# EAGLE schematic Replicape_B4 (EAGLE 9.5.1)

## Sheet 1 of 6
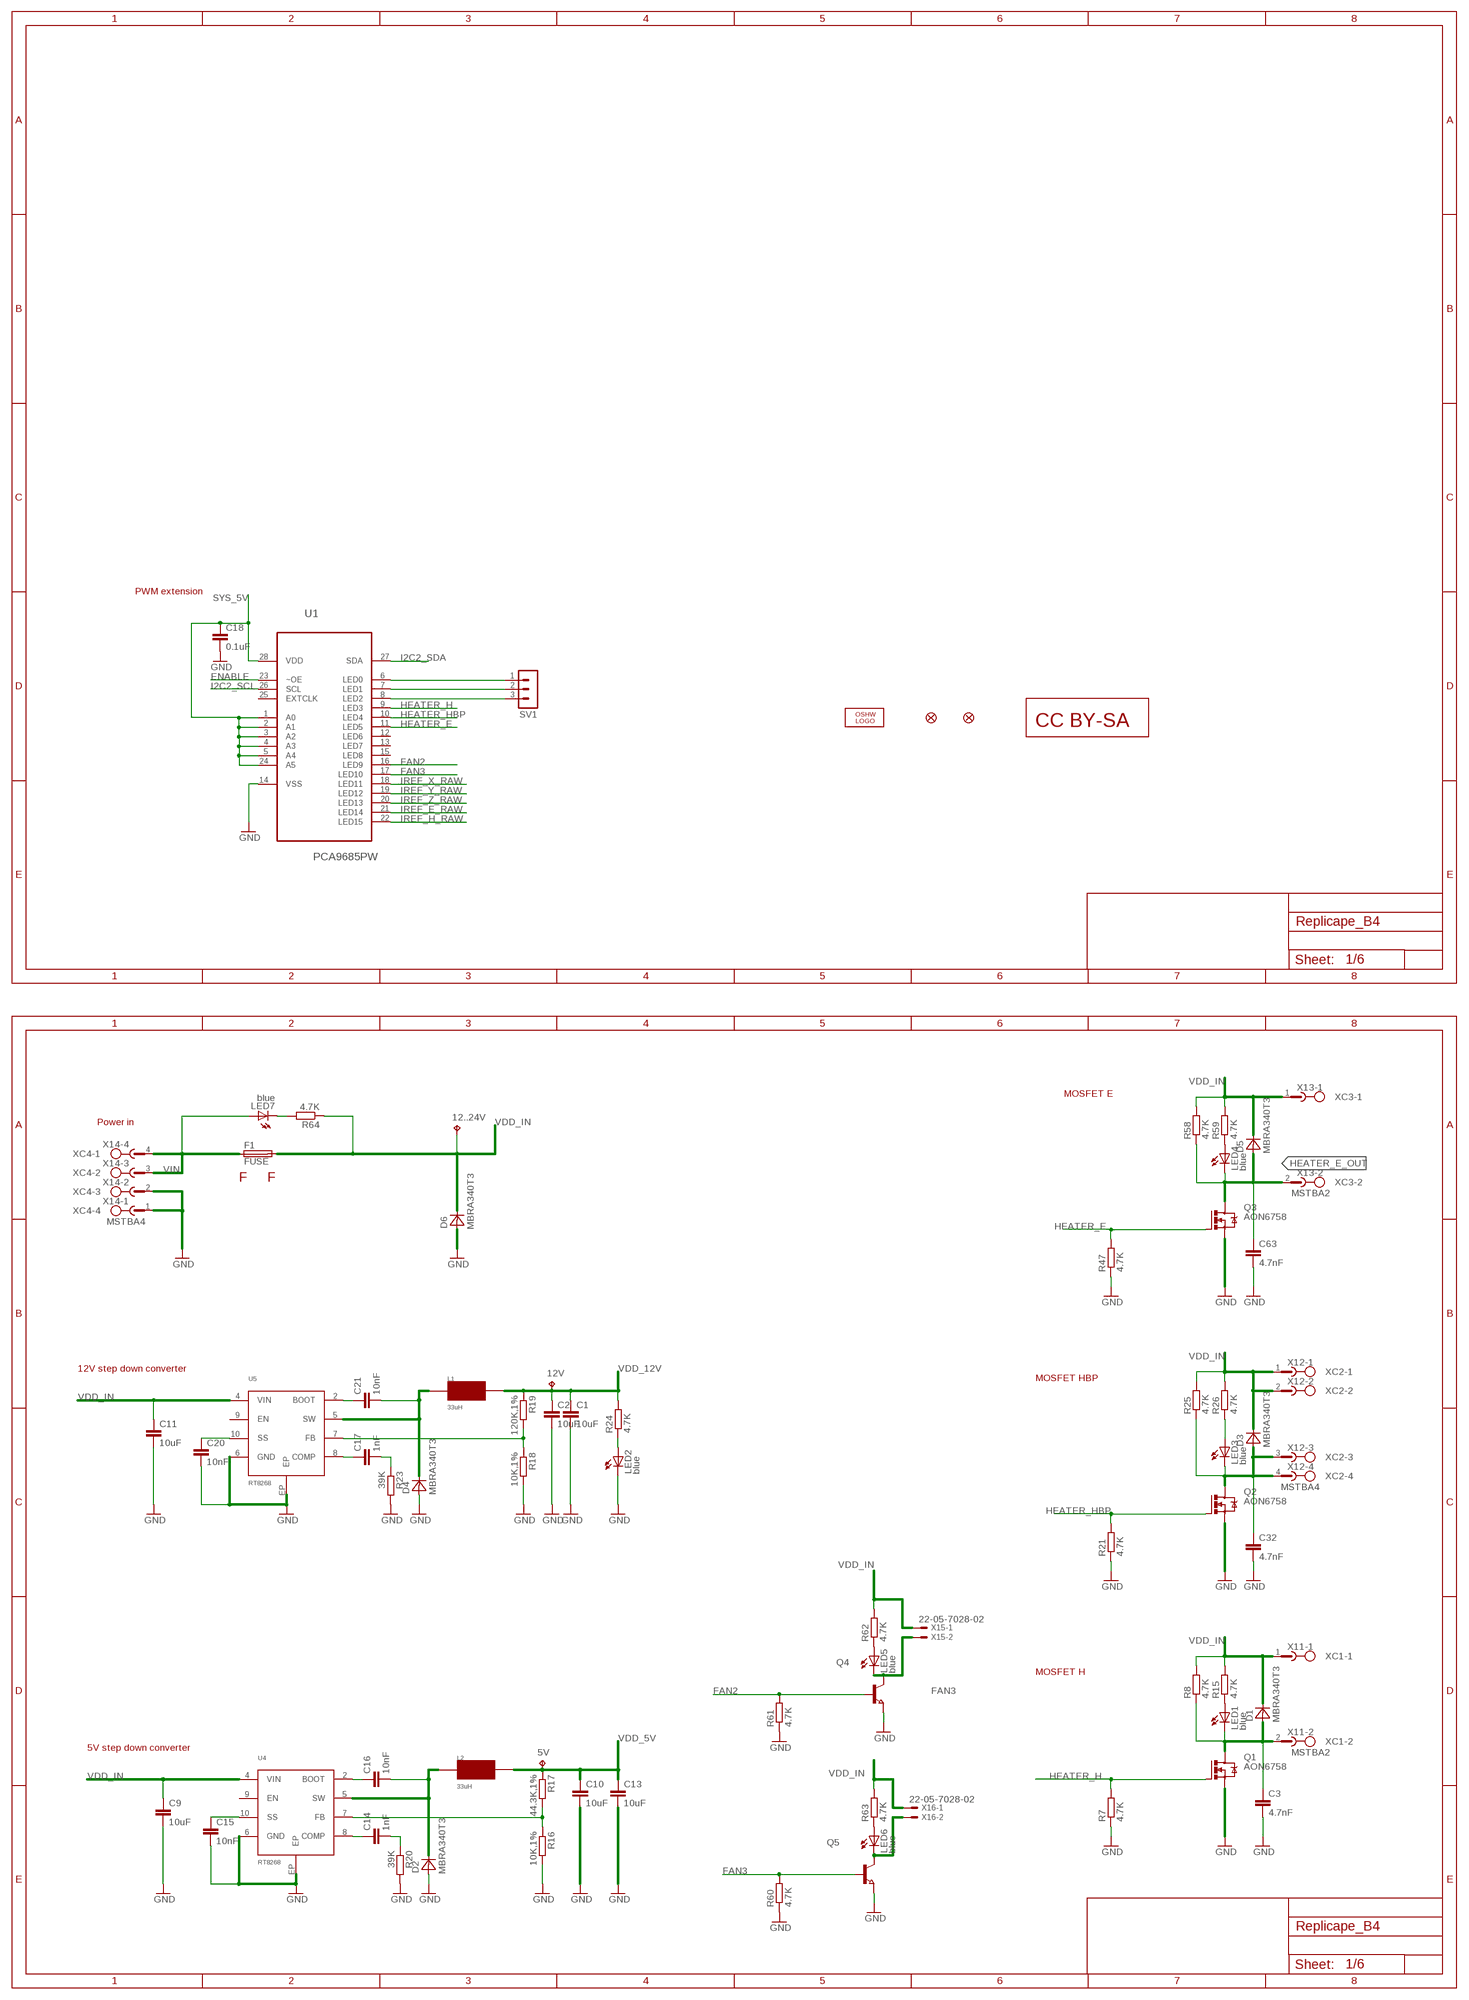
[diagram p0: schematic, sheet 1, part 1 of 2]
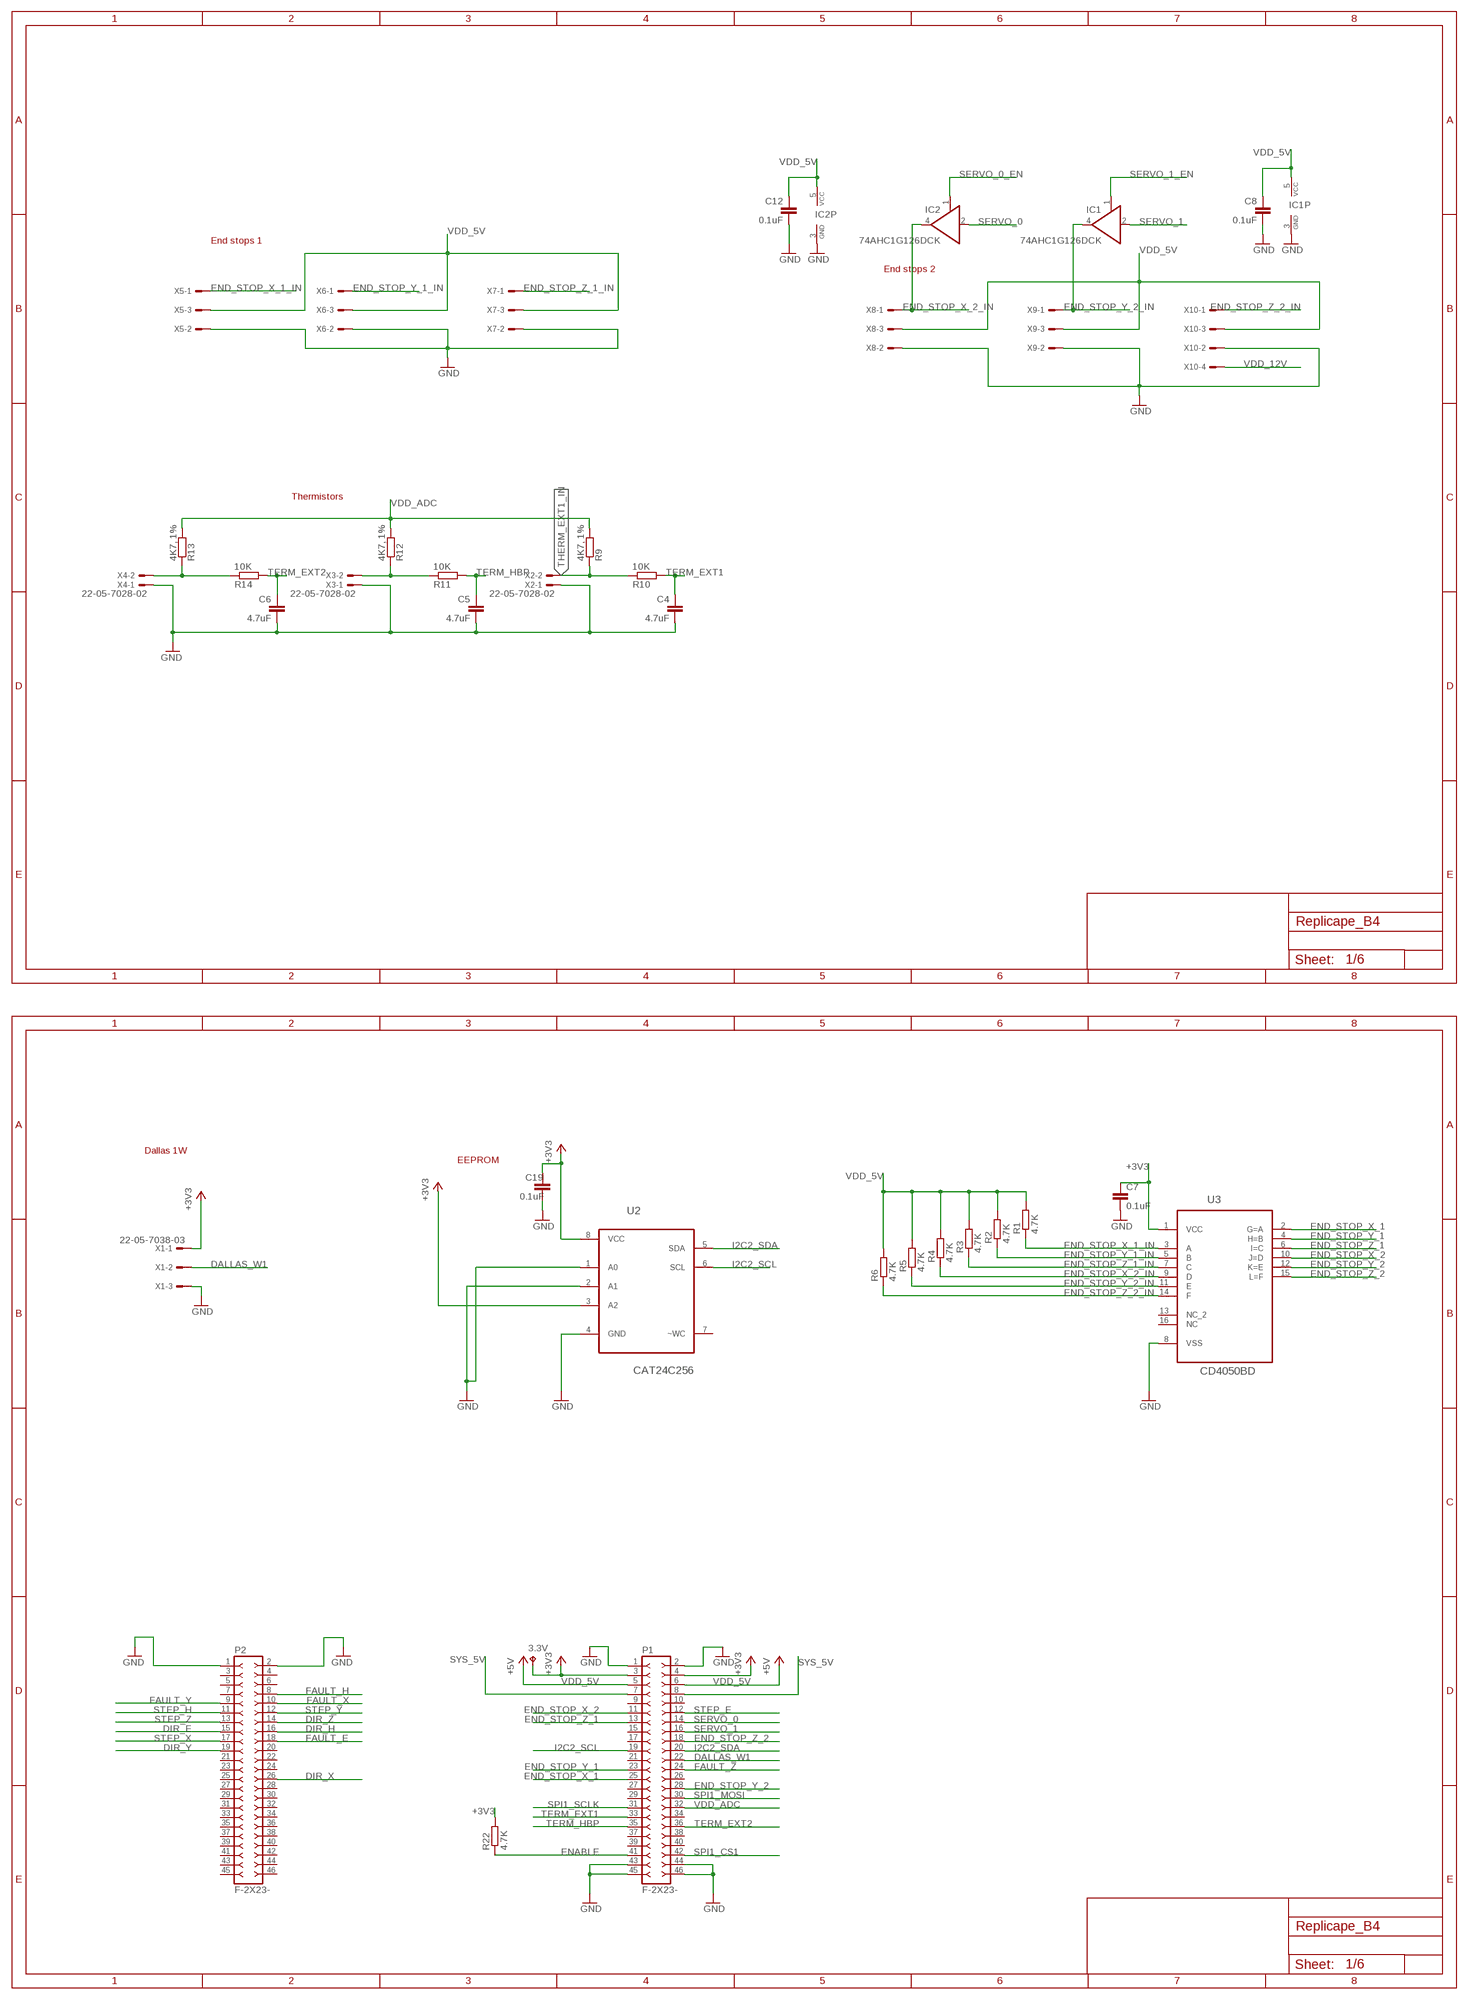
[diagram p1: schematic, sheet 1, part 2 of 2]

### Parts
3.3V  TPB1,27  [B1,27]
5V  TPB1,27  [B1,27]
12..24V  TPB1,27  [B1,27]
12V  TPB1,27  [B1,27]
C1  10uF  C-EUC1206  [C1206]
C2  10uF  C-EUC1206  [C1206]
C3  4.7nF  C-EUC0402  [C0402]
C4  4.7uF  C-EUC0402  [C0402]
C5  4.7uF  C-EUC0402  [C0402]
C6  4.7uF  C-EUC0402  [C0402]
C7  0.1uF  C-EUC0402  [C0402]
C8  0.1uF  C-EUC0402  [C0402]
C9  10uF  C-EUC1206  [C1206]
C10  10uF  C-EUC1206  [C1206]
C11  10uF  C-EUC1206  [C1206]
C12  0.1uF  C-EUC0402  [C0402]
C13  10uF  C-EUC1206  [C1206]
C14  1nF  C-EUC0402  [C0402]
C15  10nF  C-EUC0402  [C0402]
C16  10nF  C-EUC0402  [C0402]
C17  1nF  C-EUC0402  [C0402]
C18  0.1uF  C-EUC0402  [C0402]
C19  0.1uF  C-EUC0402  [C0402]
C20  10nF  C-EUC0402  [C0402]
C21  10nF  C-EUC0402  [C0402]
C32  4.7nF  C-EUC0402  [C0402]
C63  4.7nF  C-EUC0402  [C0402]
D1  MBRA340T3  [SMA]
D2  MBRA340T3  [SMA]
D3  MBRA340T3  [SMA]
D4  MBRA340T3  [SMA]
D5  MBRA340T3  [SMA]
D6  MBRA340T3  [SMA]
F1  FUSE  [3557]
FH1  FUSE-HOLDER  [FUSE-HOLDER]
FH2  FUSE-HOLDER  [FUSE-HOLDER]
IC1  74AHC1G126DCK  [SC70-5]
IC2  74AHC1G126DCK  [SC70-5]
JP1  FIDUCIAL1X2.5  [FIDUCIAL-1X2.5]
JP2  FIDUCIAL1X2.5  [FIDUCIAL-1X2.5]
L1  33uH  RT8040T330  [NR8040T330]
L2  33uH  RT8040T330  [NR8040T330]
LED1  blue  LEDCHIP-LED0603  [CHIP-LED0603]
LED2  blue  LEDCHIP-LED0603  [CHIP-LED0603]
LED3  blue  LEDCHIP-LED0603  [CHIP-LED0603]
LED4  blue  LEDCHIP-LED0603  [CHIP-LED0603]
LED5  blue  LEDCHIP-LED0603  [CHIP-LED0603]
LED6  blue  LEDCHIP-LED0603  [CHIP-LED0603]
LED7  blue  LEDCHIP-LED0603  [CHIP-LED0603]
LOGO1  OSHW_LOGO_FILLX0200-NT  [OSHW_FILLX200_NOTEXT]
P1  F-2X23-  [DIL-100-2X23]
P2  F-2X23-  [DIL-100-2X23]
Q1  AON6758  [8-DFN-EP-(5X6)]
Q2  AON6758  [8-DFN-EP-(5X6)]
Q3  AON6758  [8-DFN-EP-(5X6)]
Q4  NPN-TRANSISTOR_SOT23  [SOT23]
Q5  NPN-TRANSISTOR_SOT23  [SOT23]
R1  4.7K  R-EU_R0402  [R0402]
R2  4.7K  R-EU_R0402  [R0402]
R3  4.7K  R-EU_R0402  [R0402]
R4  4.7K  R-EU_R0402  [R0402]
R5  4.7K  R-EU_R0402  [R0402]
R6  4.7K  R-EU_R0402  [R0402]
R7  4.7K  R-EU_R0402  [R0402]
R8  4.7K  R-EU_R0402  [R0402]
R9  4K7, 1%  R-EU_R0402  [R0402]
R10  10K  R-EU_R0402  [R0402]
R11  10K  R-EU_R0402  [R0402]
R12  4K7, 1%  R-EU_R0402  [R0402]
R13  4K7, 1%  R-EU_R0402  [R0402]
R14  10K  R-EU_R0402  [R0402]
R15  4.7K  R-EU_R0402  [R0402]
R16  10K,1%  R-EU_R0402  [R0402]
R17  44.3K,1%  R-EU_R0402  [R0402]
R18  10K,1%  R-EU_R0402  [R0402]
R19  120K,1%  R-EU_R0402  [R0402]
R20  39K  R-EU_R0402  [R0402]
R21  4.7K  R-EU_R0402  [R0402]
R22  4.7K  R-EU_R0402  [R0402]
R23  39K  R-EU_R0402  [R0402]
R24  4.7K  R-EU_R0402  [R0402]
R25  4.7K  R-EU_R0402  [R0402]
R26  4.7K  R-EU_R0402  [R0402]
R47  4.7K  R-EU_R0402  [R0402]
R58  4.7K  R-EU_R0402  [R0402]
R59  4.7K  R-EU_R0402  [R0402]
R60  4.7K  R-EU_R0402  [R0402]
R61  4.7K  R-EU_R0402  [R0402]
R62  4.7K  R-EU_R0402  [R0402]
R63  4.7K  R-EU_R0402  [R0402]
R64  4.7K  R-EU_R0402  [R0402]
SV1  MA03-1  [MA03-1]
U1  PCA9685PW  [SOP65P640X110-28N]
U2  CAT24C256  [SOIC127P600X175-8N]
U3  CD4050BD  [SOIC127P600X175-16N]
U4  RT8268  [MSOP10]
U5  RT8268  [MSOP10]
U$1  CC-BY-SA  [CC-BY-SA]
X1  22-05-7038-03  [7395-03]
X2  22-05-7028-02  [7395-02]
X3  22-05-7028-02  [7395-02]
X4  22-05-7028-02  [7395-02]
X5  22-05-7038-03  [7395-03]
X6  22-05-7038-03  [7395-03]
X7  22-05-7038-03  [7395-03]
X8  22-05-7038-03  [7395-03]
X9  22-05-7038-03  [7395-03]
X10  22-05-7048-04  [7395-04]
X11  MSTBA2  [MSTBA2]
X12  MSTBA4  [MSTBA4]
X13  MSTBA2  [MSTBA2]
X14  MSTBA4  [MSTBA4]
X15  22-05-7028-02  [7395-02]
X16  22-05-7028-02  [7395-02]
XC1  MSTBV2-CONNECTOR  [MSTBA2-CONNECTOR]
XC2  MSTBA4-CONNECTOR  [MSTBA4-CONNECTOR]
XC3  MSTBV2-CONNECTOR  [MSTBA2-CONNECTOR]
XC4  MSTBA4-CONNECTOR  [MSTBA4-CONNECTOR]

### Nets
+3V3: 3.3V.TP C7.1 C19.1 P1.3 P1.4 R22.2 U2.3(A2) U2.8(VCC) U3.1(VCC) X1.1 ; also sheet 2,3,4,5,6
DALLAS_W1: P1.22 X1.2
DIR_E: P2.15 ; also sheet 3
DIR_H: P2.16 ; also sheet 6
DIR_X: P2.26 ; also sheet 4
DIR_Y: P2.19 ; also sheet 5
DIR_Z: P2.14 ; also sheet 2
ENABLE: P1.41 R22.1 U1.23(~OE)
END_STOP_X_1: P1.25 U3.2(G=A)
END_STOP_X_1_IN: R1.1 U3.3(A) X5.1
END_STOP_X_2: P1.11 U3.10(J=D)
END_STOP_X_2_IN: IC2.4(O) R4.1 U3.9(D) X8.1
END_STOP_Y_1: P1.23 U3.4(H=B)
END_STOP_Y_1_IN: R2.1 U3.5(B) X6.1
END_STOP_Y_2: P1.28 U3.12(K=E)
END_STOP_Y_2_IN: IC1.4(O) R5.1 U3.11(E) X9.1
END_STOP_Z_1: P1.13 U3.6(I=C)
END_STOP_Z_1_IN: R3.1 U3.7(C) X7.1
END_STOP_Z_2: P1.18 U3.15(L=F)
END_STOP_Z_2_IN: R6.1 U3.14(F) X10.1
FAN2: Q4.1(B) R61.2 U1.16(LED9)
FAN3: Q5.1(B) R60.2 U1.17(LED10)
FAULT_E: P2.18 ; also sheet 3
FAULT_H: P2.8 ; also sheet 6
FAULT_X: P2.10 ; also sheet 4
FAULT_Y: P2.9 ; also sheet 5
FAULT_Z: P1.24 ; also sheet 2
GND: C1.2 C2.2 C3.2 C4.2 C5.2 C6.2 C7.2 C8.2 C9.2 C10.2 C11.2 C12.2 C13.2 C15.2 C18.2 C19.2 C20.2 C32.2 C63.2 D2.A D4.A D6.A IC1.3(GND) IC2.3(GND) LED2.C P1.1 P1.2 P1.43 P1.44 P1.45 P1.46 P2.1 P2.2 Q1.1(S) Q1.2(S) Q1.3(S) Q2.1(S) Q2.2(S) Q2.3(S) Q3.1(S) Q3.2(S) Q3.3(S) Q4.2(E) Q5.2(E) R7.1 R16.2 R18.2 R20.2 R21.1 R23.2 R47.1 R60.1 R61.1 U1.14(VSS) U2.1(A0) U2.2(A1) U2.4(GND) U3.8(VSS) U4.6(GND) U4.EP U5.6(GND) U5.EP X1.3 X2.1 X3.1 X4.1 X5.2 X6.2 X7.2 X8.2 X9.2 X10.2 X14.1 X14.2 ; also sheet 2,3,4,5,6
HEATER_E: Q3.4(G) R47.2 U1.11(LED5)
HEATER_E_OUT: C63.1 D5.A LED4.C Q3.5(D) Q3.6(D) Q3.7(D) Q3.8(D) Q3.TH(D) R58.1 X13.2
HEATER_H: Q1.4(G) R7.2 U1.9(LED3)
HEATER_HBP: Q2.4(G) R21.2 U1.10(LED4)
I2C2_SCL: P1.19 U1.26(SCL) U2.6(SCL)
I2C2_SDA: P1.20 U1.27(SDA) U2.5(SDA)
IREF_E_RAW: U1.21(LED14) ; also sheet 3
IREF_H_RAW: U1.22(LED15) ; also sheet 6
IREF_X_RAW: U1.18(LED11) ; also sheet 4
IREF_Y_RAW: U1.19(LED12) ; also sheet 5
IREF_Z_RAW: U1.20(LED13) ; also sheet 2
N$1: SV1.1 U1.6(LED0)
N$8: LED7.C R64.2
N$23: R16.1 R17.2 U4.7(FB)
N$25: C16.2 D2.C L2.P$2 U4.5(SW)
N$60: C15.1 U4.10(SS)
N$64: C3.1 D1.A LED1.C Q1.5(D) Q1.6(D) Q1.7(D) Q1.8(D) Q1.TH(D) R8.1 X11.2
N$73: C16.1 U4.2(BOOT)
N$88: C14.1 U4.8(COMP)
N$96: LED2.A R24.1
N$97: C14.2 R20.1
N$114: LED6.C Q5.3(C) X16.2
N$115: LED5.C Q4.3(C) X15.2
N$117: LED5.A R62.1
N$118: LED6.A R63.1
N$120: SV1.3 U1.8(LED2)
N$121: SV1.2 U1.7(LED1)
N$127: LED4.A R59.1
N$129: LED1.A R15.1
N$130: LED3.A R26.1
N$233: R18.1 R19.2 U5.7(FB)
N$238: C21.2 D4.C L1.P$2 U5.5(SW)
N$240: R13.1 R14.1 X4.2
N$241: R11.1 R12.1 X3.2
N$242: C32.1 D3.A LED3.C Q2.5(D) Q2.6(D) Q2.7(D) Q2.8(D) Q2.TH(D) R25.1 X12.3 X12.4
N$243: C20.1 U5.10(SS)
N$244: C17.1 U5.8(COMP)
N$245: C21.1 U5.2(BOOT)
N$246: C17.2 R23.1
SERVO_0: IC2.2(I) P1.14
SERVO_0_EN: IC2.1(OE) ; also sheet 5
SERVO_1: IC1.2(I) P1.16
SERVO_1_EN: IC1.1(OE) ; also sheet 2
SPI1_CS1: P1.42 ; also sheet 2,3,4,5,6
SPI1_MOSI: P1.30 ; also sheet 4
SPI1_SCLK: P1.31 ; also sheet 2,3,4,5,6
STEP_E: P1.12 ; also sheet 3
STEP_H: P2.11 ; also sheet 6
STEP_X: P2.17 ; also sheet 4
STEP_Y: P2.12 ; also sheet 5
STEP_Z: P2.13 ; also sheet 2
SYS_5V: C18.1 P1.7 P1.8 U1.1(A0) U1.2(A1) U1.3(A2) U1.4(A3) U1.5(A4) U1.24(A5) U1.28(VDD)
TERM_EXT1: C4.1 P1.33 R10.2
TERM_EXT2: C6.1 P1.36 R14.2
TERM_HBP: C5.1 P1.35 R11.2
THERM_EXT1_IN: R9.1 R10.1 X2.2
VDD_5V: 5V.TP C8.1 C10.1 C12.1 C13.1 IC1.5(VCC) IC2.5(VCC) L2.P$1 P1.5 P1.6 R1.2 R2.2 R3.2 R4.2 R5.2 R6.2 R17.1 X5.3 X6.3 X7.3 X8.3 X9.3 X10.3 ; supply symbol labelled +5V
VDD_12V: 12V.TP C1.1 C2.1 L1.P$1 R19.1 R24.2 X10.4
VDD_ADC: P1.32 R9.2 R12.2 R13.2
VDD_IN: 12..24V.TP C9.1 C11.1 D1.C D3.C D5.C D6.C F1.P$3 F1.P$4 R8.2 R15.2 R25.2 R26.2 R58.2 R59.2 R62.2 R63.2 R64.1 U4.4(VIN) U5.4(VIN) X11.1 X12.1 X12.2 X13.1 X15.1 X16.1 ; also sheet 2,3,4,5,6
VIN: F1.P$1 F1.P$2 LED7.A X14.3 X14.4
Unconnected: P1.9 P1.10 P1.15 P1.17 P1.21 P1.26 P1.27 P1.29 P1.34 P1.37 P1.38 P1.39 P1.40 P2.3 P2.4 P2.5 P2.6 P2.7 P2.20 P2.21 P2.22 P2.23 P2.24 P2.25 P2.27 P2.28 P2.29 P2.30 P2.31 P2.32 P2.33 P2.34 P2.35 P2.36 P2.37 P2.38 P2.39 P2.40 P2.41 P2.42 P2.43 P2.44 P2.45 P2.46 U1.12(LED6) U1.13(LED7) U1.15(LED8) U1.25(EXTCLK) U2.7(~WC) U3.13(NC_2) U3.16(NC) U4.9(EN) U5.9(EN)

### Notes on the sheet
- End stops 1
- End stops 2
- Thermistors
- PWM extension
- MOSFET E
- Power in
- Dallas 1W
- EEPROM
- 12V step down converter
- MOSFET HBP
- MOSFET H
- 5V step down converter

## Sheet 2 of 6
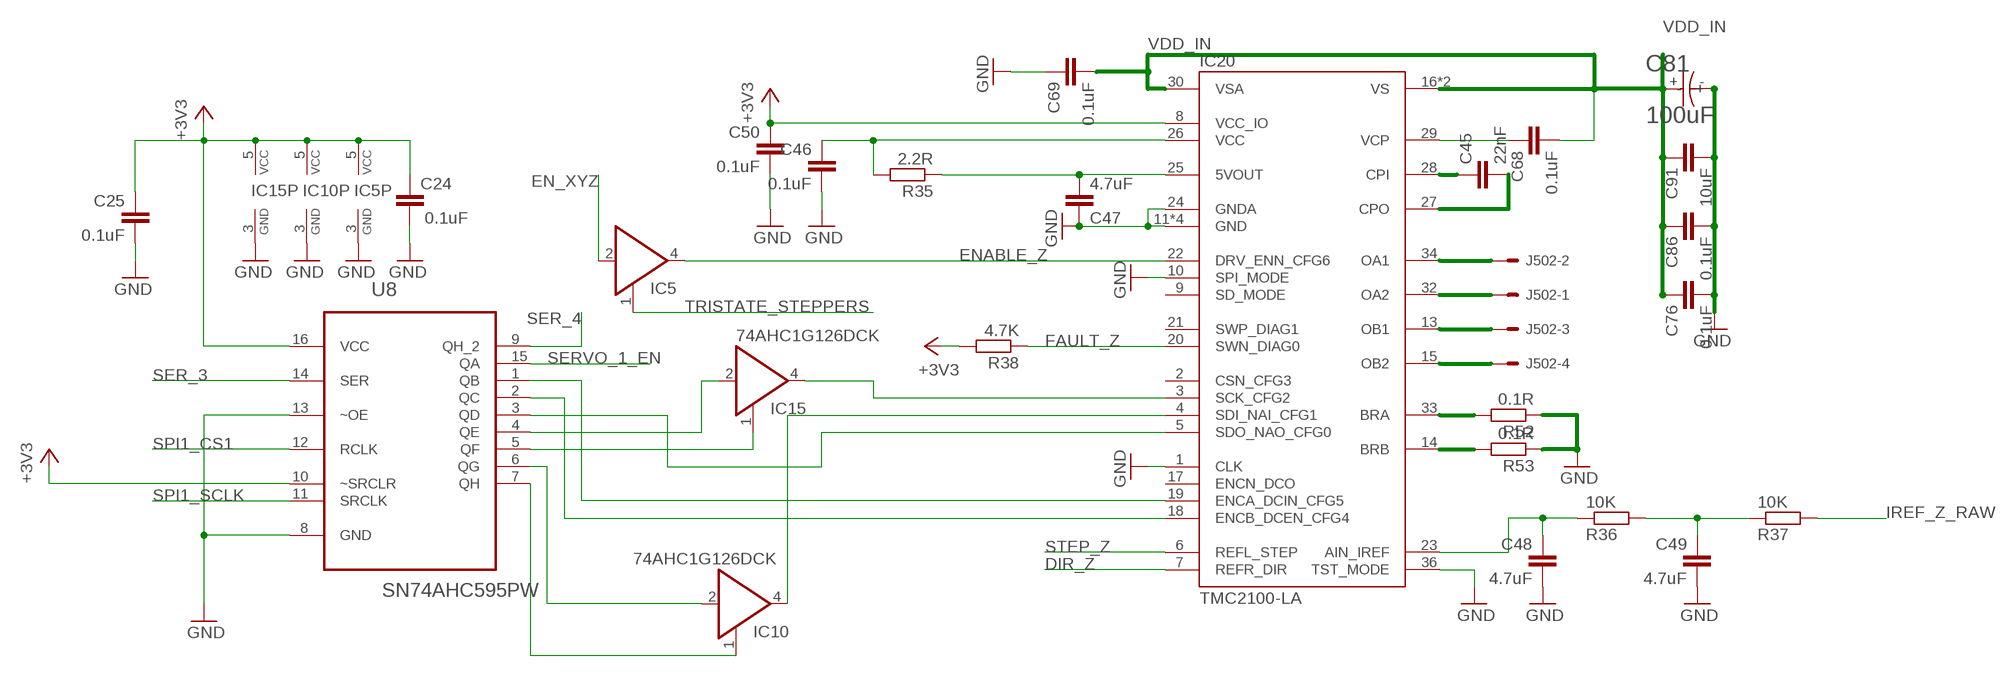
[diagram p2: schematic, sheet 2]

### Parts
C24  0.1uF  C-EUC0402  [C0402]
C25  0.1uF  C-EUC0402  [C0402]
C45  22nF  C-EUC0402  [C0402]
C46  0.1uF  C-EUC0402  [C0402]
C47  4.7uF  C-EUC0402  [C0402]
C48  4.7uF  C-EUC0402  [C0402]
C49  4.7uF  C-EUC0402  [C0402]
C50  0.1uF  C-EUC0402  [C0402]
C68  0.1uF  C-EUC0402  [C0402]
C69  0.1uF  C-EUC0402  [C0402]
C76  0.1uF  C-EUC0402  [C0402]
C81  100uF  C  [RHS1V10MCN1GS]
C86  0.1uF  C-EUC0402  [C0402]
C91  10uF  C-EUC0805  [C0805]
IC5  74AHC1G126DCK  [SC70-5]
IC10  74AHC1G126DCK  [SC70-5]
IC15  74AHC1G126DCK  [SC70-5]
IC20  TMC2100-LA  [QFN36-PAD]
J502  22-05-7048-04  [7395-04]
R35  2.2R  R-EU_R0402  [R0402]
R36  10K  R-EU_R0402  [R0402]
R37  10K  R-EU_R0402  [R0402]
R38  4.7K  R-EU_R0402  [R0402]
R52  0.1R  R-EU_R0805  [R0805]
R53  0.1R  R-EU_R0805  [R0805]
U8  SN74AHC595PW  [SOP65P640X120-16N]

### Nets
+3V3: C24.1 C25.1 C50.1 IC5.5(VCC) IC10.5(VCC) IC15.5(VCC) IC20.8(VCC_IO) R38.2 U8.10(~SRCLR) U8.16(VCC) ; also sheet 1,3,4,5,6
DIR_Z: IC20.7(REFR_DIR) ; also sheet 1
EN_XYZ: IC5.2(I) ; also sheet 4,5
ENABLE_Z: IC5.4(O) IC20.22(DRV_ENN_CFG6)
FAULT_Z: IC20.20(SWN_DIAG0) R38.1 ; also sheet 1
GND: C24.2 C25.2 C46.2 C47.1 C48.2 C49.2 C50.2 C69.1 C76.2 C81.- C86.2 C91.2 IC5.3(GND) IC10.3(GND) IC15.3(GND) IC20.1(CLK) IC20.10(SPI_MODE) IC20.11(GND) IC20.12(GND) IC20.24(GNDA) IC20.35(GND) IC20.36(TST_MODE) IC20.TP(GND) R52.1 R53.1 U8.8(GND) U8.13(~OE) ; also sheet 1,3,4,5,6
IREF_Z6: C49.1 R36.2 R37.1
IREF_Z_RAW: R37.2 ; also sheet 1
N$2: C45.2 IC20.27(CPO)
N$3: IC20.14(BRB) R53.2
N$4: IC20.33(BRA) R52.2
N$5: C48.1 IC20.23(AIN_IREF) R36.1
N$6: C45.1 IC20.28(CPI)
N$12: IC15.4(O) IC20.3(SCK_CFG2)
N$13: C47.2 IC20.25(5VOUT) R35.1
N$14: C68.1 IC20.29(VCP)
N$15: IC10.4(O) IC20.4(SDI_NAI_CFG1)
N$16: IC20.5(SDO_NAO_CFG0) U8.3(QD)
N$17: IC20.18(ENCB_DCEN_CFG4) U8.2(QC)
N$18: IC20.19(ENCA_DCIN_CFG5) U8.1(QB)
N$19: IC10.1(OE) U8.7(QH)
N$20: IC10.2(I) U8.6(QG)
N$22: IC15.2(I) U8.4(QE)
N$24: IC15.1(OE) U8.5(QF)
N$26: C46.1 IC20.26(VCC) R35.2
N$122: IC20.15(OB2) J502.4
N$123: IC20.34(OA1) J502.2
N$138: IC20.32(OA2) J502.1
N$139: IC20.13(OB1) J502.3
SER_3: U8.14(SER) ; also sheet 5
SER_4: U8.9(QH_2) ; also sheet 3
SERVO_1_EN: U8.15(QA) ; also sheet 1
SPI1_CS1: U8.12(RCLK) ; also sheet 1,3,4,5,6
SPI1_SCLK: U8.11(SRCLK) ; also sheet 1,3,4,5,6
STEP_Z: IC20.6(REFL_STEP) ; also sheet 1
TRISTATE_STEPPERS: IC5.1(OE) ; also sheet 3,4,5,6
VDD_IN: C68.2 C69.2 C76.1 C81.+ C86.1 C91.1 IC20.16(VS) IC20.30(VSA) IC20.31(VS) ; also sheet 1,3,4,5,6
Unconnected: IC20.2(CSN_CFG3) IC20.9(SD_MODE) IC20.17(ENCN_DCO) IC20.21(SWP_DIAG1)

## Sheet 3 of 6
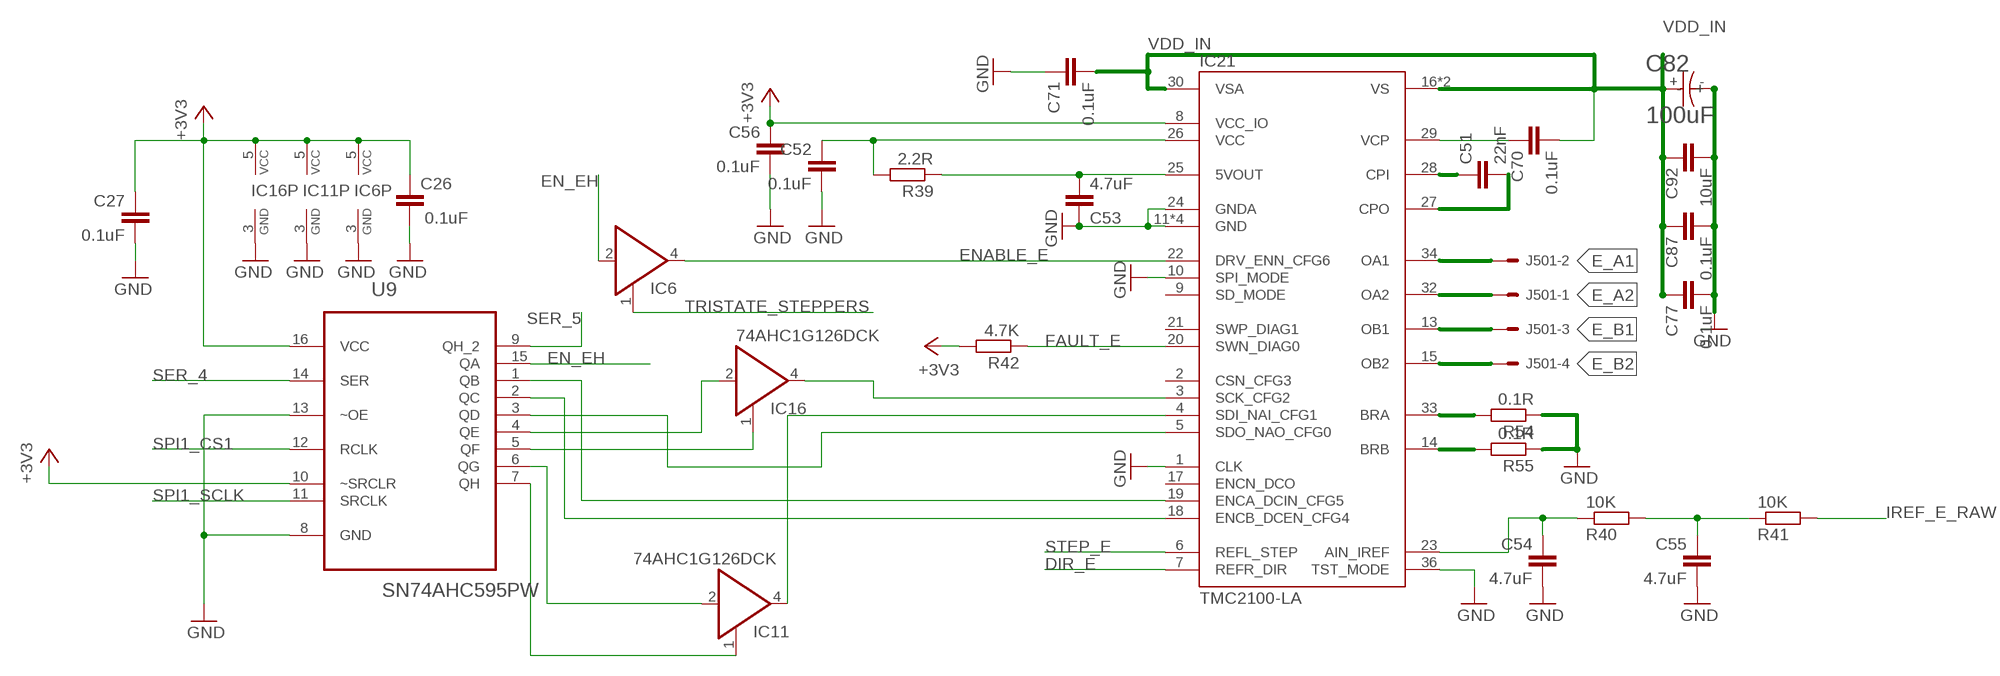
[diagram p3: schematic, sheet 3]

### Parts
C26  0.1uF  C-EUC0402  [C0402]
C27  0.1uF  C-EUC0402  [C0402]
C51  22nF  C-EUC0402  [C0402]
C52  0.1uF  C-EUC0402  [C0402]
C53  4.7uF  C-EUC0402  [C0402]
C54  4.7uF  C-EUC0402  [C0402]
C55  4.7uF  C-EUC0402  [C0402]
C56  0.1uF  C-EUC0402  [C0402]
C70  0.1uF  C-EUC0402  [C0402]
C71  0.1uF  C-EUC0402  [C0402]
C77  0.1uF  C-EUC0402  [C0402]
C82  100uF  C  [RHS1V10MCN1GS]
C87  0.1uF  C-EUC0402  [C0402]
C92  10uF  C-EUC0805  [C0805]
IC6  74AHC1G126DCK  [SC70-5]
IC11  74AHC1G126DCK  [SC70-5]
IC16  74AHC1G126DCK  [SC70-5]
IC21  TMC2100-LA  [QFN36-PAD]
J501  22-05-7048-04  [7395-04]
R39  2.2R  R-EU_R0402  [R0402]
R40  10K  R-EU_R0402  [R0402]
R41  10K  R-EU_R0402  [R0402]
R42  4.7K  R-EU_R0402  [R0402]
R54  0.1R  R-EU_R0805  [R0805]
R55  0.1R  R-EU_R0805  [R0805]
U9  SN74AHC595PW  [SOP65P640X120-16N]

### Nets
+3V3: C26.1 C27.1 C56.1 IC6.5(VCC) IC11.5(VCC) IC16.5(VCC) IC21.8(VCC_IO) R42.2 U9.10(~SRCLR) U9.16(VCC) ; also sheet 1,2,4,5,6
DIR_E: IC21.7(REFR_DIR) ; also sheet 1
E_A1: IC21.34(OA1) J501.2
E_A2: IC21.32(OA2) J501.1
E_B1: IC21.13(OB1) J501.3
E_B2: IC21.15(OB2) J501.4
EN_EH: IC6.2(I) U9.15(QA) ; also sheet 6
ENABLE_E: IC6.4(O) IC21.22(DRV_ENN_CFG6)
FAULT_E: IC21.20(SWN_DIAG0) R42.1 ; also sheet 1
GND: C26.2 C27.2 C52.2 C53.1 C54.2 C55.2 C56.2 C71.1 C77.2 C82.- C87.2 C92.2 IC6.3(GND) IC11.3(GND) IC16.3(GND) IC21.1(CLK) IC21.10(SPI_MODE) IC21.11(GND) IC21.12(GND) IC21.24(GNDA) IC21.35(GND) IC21.36(TST_MODE) IC21.TP(GND) R54.1 R55.1 U9.8(GND) U9.13(~OE) ; also sheet 1,2,4,5,6
IREF_E_RAW: R41.2 ; also sheet 1
IREF_Z7: C55.1 R40.2 R41.1
N$27: C51.2 IC21.27(CPO)
N$28: IC21.14(BRB) R55.2
N$29: IC21.33(BRA) R54.2
N$30: C54.1 IC21.23(AIN_IREF) R40.1
N$31: C51.1 IC21.28(CPI)
N$32: IC16.4(O) IC21.3(SCK_CFG2)
N$35: C53.2 IC21.25(5VOUT) R39.1
N$36: C70.1 IC21.29(VCP)
N$37: IC11.4(O) IC21.4(SDI_NAI_CFG1)
N$38: IC21.5(SDO_NAO_CFG0) U9.3(QD)
N$40: IC21.18(ENCB_DCEN_CFG4) U9.2(QC)
N$41: IC21.19(ENCA_DCIN_CFG5) U9.1(QB)
N$42: IC11.1(OE) U9.7(QH)
N$43: IC11.2(I) U9.6(QG)
N$44: IC16.2(I) U9.4(QE)
N$45: IC16.1(OE) U9.5(QF)
N$46: C52.1 IC21.26(VCC) R39.2
SER_4: U9.14(SER) ; also sheet 2
SER_5: U9.9(QH_2) ; also sheet 6
SPI1_CS1: U9.12(RCLK) ; also sheet 1,2,4,5,6
SPI1_SCLK: U9.11(SRCLK) ; also sheet 1,2,4,5,6
STEP_E: IC21.6(REFL_STEP) ; also sheet 1
TRISTATE_STEPPERS: IC6.1(OE) ; also sheet 2,4,5,6
VDD_IN: C70.2 C71.2 C77.1 C82.+ C87.1 C92.1 IC21.16(VS) IC21.30(VSA) IC21.31(VS) ; also sheet 1,2,4,5,6
Unconnected: IC21.2(CSN_CFG3) IC21.9(SD_MODE) IC21.17(ENCN_DCO) IC21.21(SWP_DIAG1)

## Sheet 4 of 6
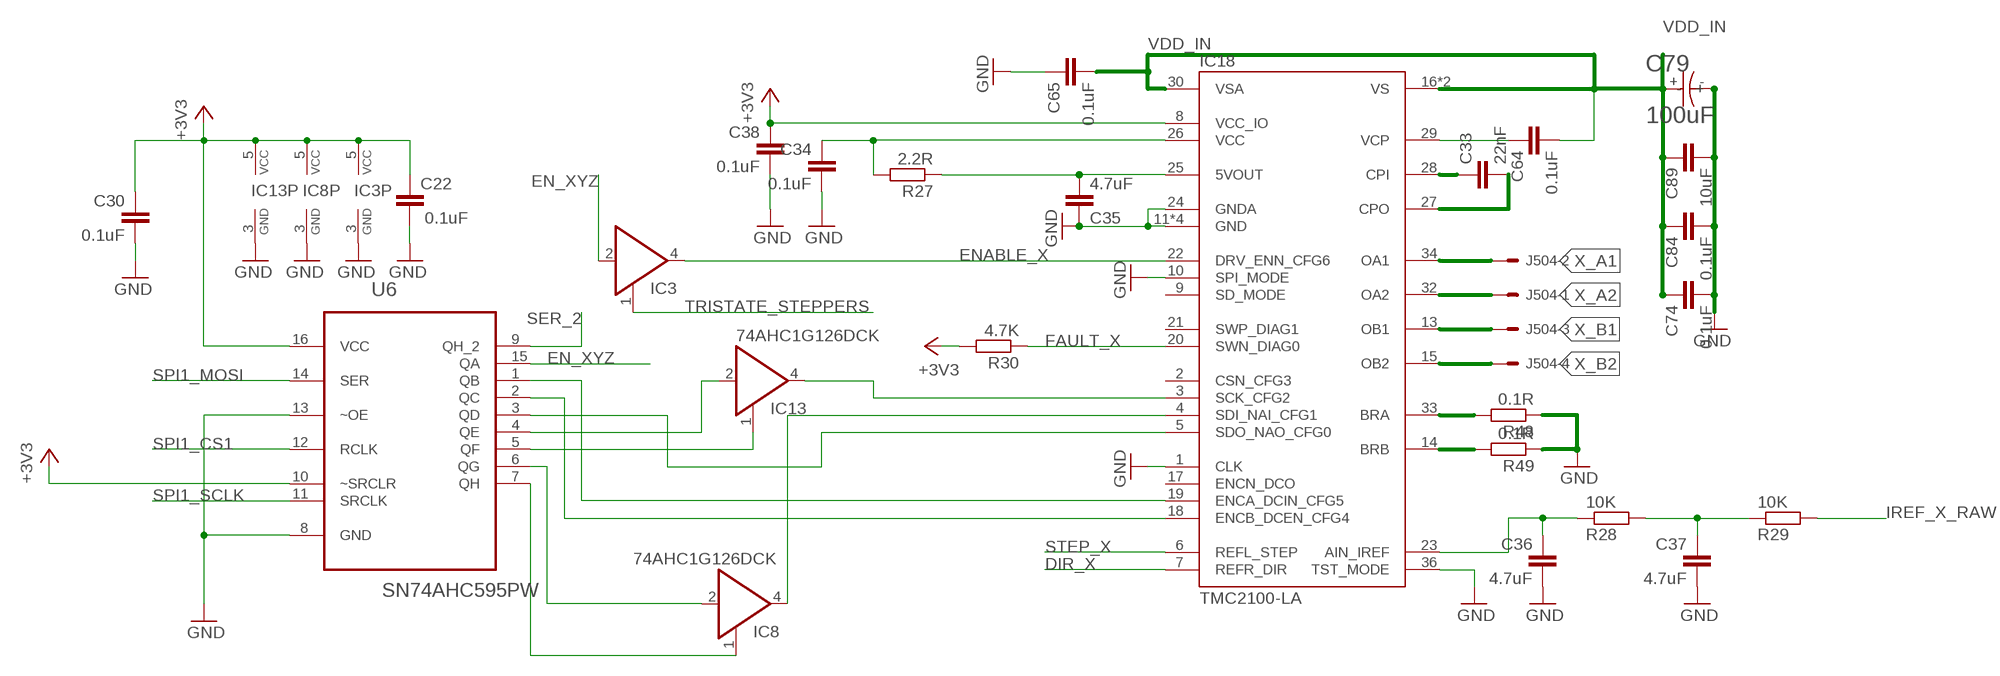
[diagram p4: schematic, sheet 4]

### Parts
C22  0.1uF  C-EUC0402  [C0402]
C30  0.1uF  C-EUC0402  [C0402]
C33  22nF  C-EUC0402  [C0402]
C34  0.1uF  C-EUC0402  [C0402]
C35  4.7uF  C-EUC0402  [C0402]
C36  4.7uF  C-EUC0402  [C0402]
C37  4.7uF  C-EUC0402  [C0402]
C38  0.1uF  C-EUC0402  [C0402]
C64  0.1uF  C-EUC0402  [C0402]
C65  0.1uF  C-EUC0402  [C0402]
C74  0.1uF  C-EUC0402  [C0402]
C79  100uF  C  [RHS1V10MCN1GS]
C84  0.1uF  C-EUC0402  [C0402]
C89  10uF  C-EUC0805  [C0805]
IC3  74AHC1G126DCK  [SC70-5]
IC8  74AHC1G126DCK  [SC70-5]
IC13  74AHC1G126DCK  [SC70-5]
IC18  TMC2100-LA  [QFN36-PAD]
J504  22-05-7048-04  [7395-04]
R27  2.2R  R-EU_R0402  [R0402]
R28  10K  R-EU_R0402  [R0402]
R29  10K  R-EU_R0402  [R0402]
R30  4.7K  R-EU_R0402  [R0402]
R48  0.1R  R-EU_R0805  [R0805]
R49  0.1R  R-EU_R0805  [R0805]
U6  SN74AHC595PW  [SOP65P640X120-16N]

### Nets
+3V3: C22.1 C30.1 C38.1 IC3.5(VCC) IC8.5(VCC) IC13.5(VCC) IC18.8(VCC_IO) R30.2 U6.10(~SRCLR) U6.16(VCC) ; also sheet 1,2,3,5,6
DIR_X: IC18.7(REFR_DIR) ; also sheet 1
EN_XYZ: IC3.2(I) U6.15(QA) ; also sheet 2,5
ENABLE_X: IC3.4(O) IC18.22(DRV_ENN_CFG6)
FAULT_X: IC18.20(SWN_DIAG0) R30.1 ; also sheet 1
GND: C22.2 C30.2 C34.2 C35.1 C36.2 C37.2 C38.2 C65.1 C74.2 C79.- C84.2 C89.2 IC3.3(GND) IC8.3(GND) IC13.3(GND) IC18.1(CLK) IC18.10(SPI_MODE) IC18.11(GND) IC18.12(GND) IC18.24(GNDA) IC18.35(GND) IC18.36(TST_MODE) IC18.TP(GND) R48.1 R49.1 U6.8(GND) U6.13(~OE) ; also sheet 1,2,3,5,6
IREF_X_RAW: R29.2 ; also sheet 1
IREF_Z8: C37.1 R28.2 R29.1
N$49: C33.2 IC18.27(CPO)
N$50: IC18.14(BRB) R49.2
N$51: IC18.33(BRA) R48.2
N$52: C36.1 IC18.23(AIN_IREF) R28.1
N$53: C33.1 IC18.28(CPI)
N$54: IC13.4(O) IC18.3(SCK_CFG2)
N$57: C35.2 IC18.25(5VOUT) R27.1
N$58: C64.1 IC18.29(VCP)
N$59: IC8.4(O) IC18.4(SDI_NAI_CFG1)
N$61: IC18.5(SDO_NAO_CFG0) U6.3(QD)
N$62: IC18.18(ENCB_DCEN_CFG4) U6.2(QC)
N$63: IC18.19(ENCA_DCIN_CFG5) U6.1(QB)
N$65: IC8.1(OE) U6.7(QH)
N$66: IC8.2(I) U6.6(QG)
N$67: IC13.2(I) U6.4(QE)
N$68: IC13.1(OE) U6.5(QF)
N$69: C34.1 IC18.26(VCC) R27.2
SER_2: U6.9(QH_2) ; also sheet 5
SPI1_CS1: U6.12(RCLK) ; also sheet 1,2,3,5,6
SPI1_MOSI: U6.14(SER) ; also sheet 1
SPI1_SCLK: U6.11(SRCLK) ; also sheet 1,2,3,5,6
STEP_X: IC18.6(REFL_STEP) ; also sheet 1
TRISTATE_STEPPERS: IC3.1(OE) ; also sheet 2,3,5,6
VDD_IN: C64.2 C65.2 C74.1 C79.+ C84.1 C89.1 IC18.16(VS) IC18.30(VSA) IC18.31(VS) ; also sheet 1,2,3,5,6
X_A1: IC18.34(OA1) J504.2
X_A2: IC18.32(OA2) J504.1
X_B1: IC18.13(OB1) J504.3
X_B2: IC18.15(OB2) J504.4
Unconnected: IC18.2(CSN_CFG3) IC18.9(SD_MODE) IC18.17(ENCN_DCO) IC18.21(SWP_DIAG1)

## Sheet 5 of 6
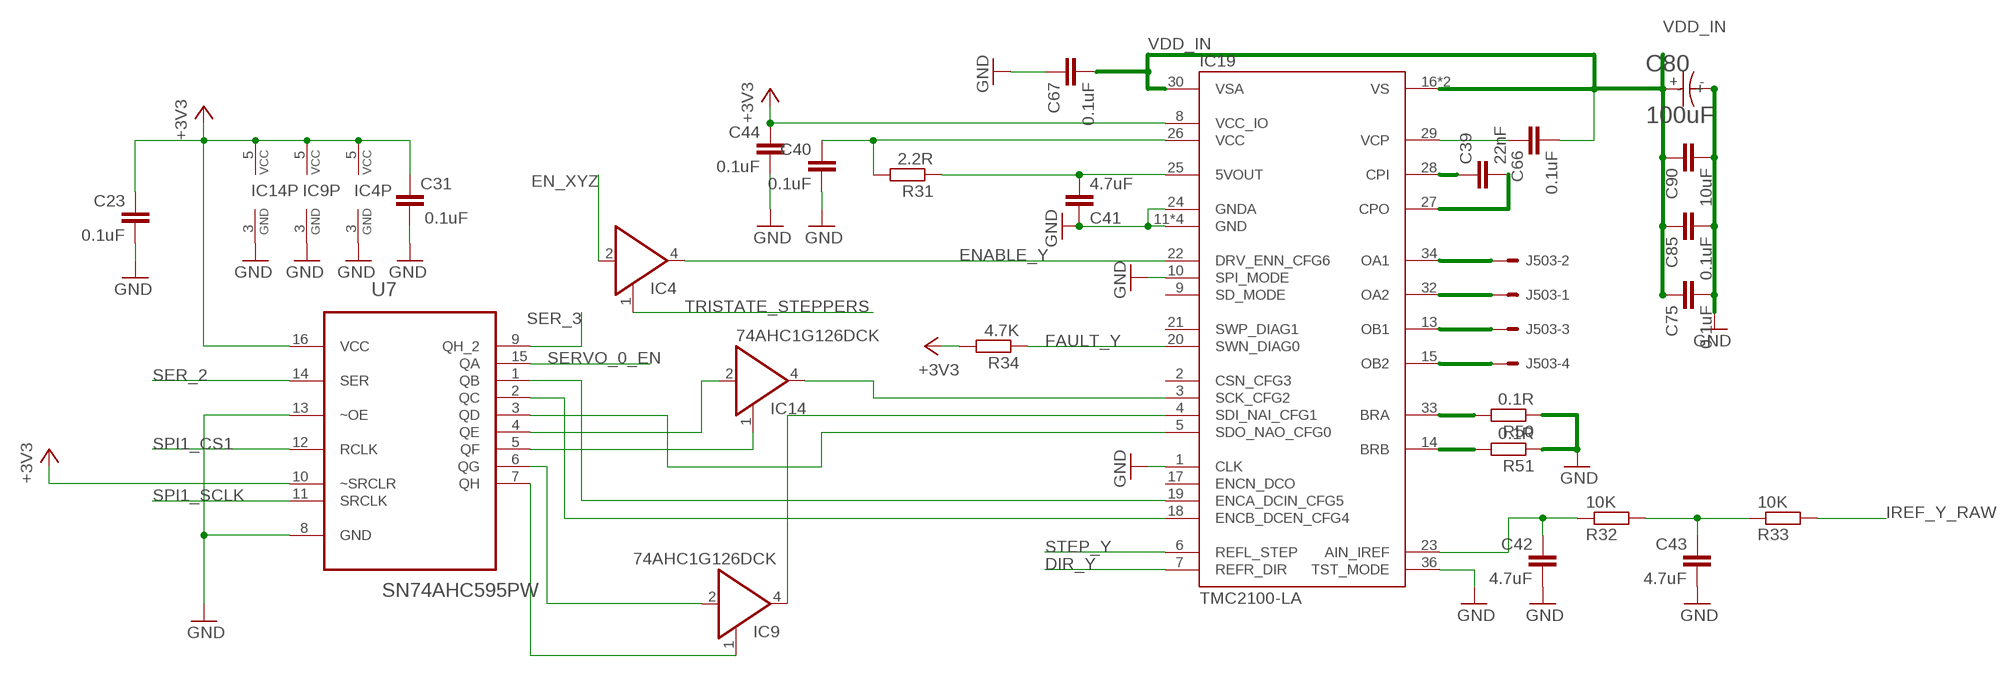
[diagram p5: schematic, sheet 5]

### Parts
C23  0.1uF  C-EUC0402  [C0402]
C31  0.1uF  C-EUC0402  [C0402]
C39  22nF  C-EUC0402  [C0402]
C40  0.1uF  C-EUC0402  [C0402]
C41  4.7uF  C-EUC0402  [C0402]
C42  4.7uF  C-EUC0402  [C0402]
C43  4.7uF  C-EUC0402  [C0402]
C44  0.1uF  C-EUC0402  [C0402]
C66  0.1uF  C-EUC0402  [C0402]
C67  0.1uF  C-EUC0402  [C0402]
C75  0.1uF  C-EUC0402  [C0402]
C80  100uF  C  [RHS1V10MCN1GS]
C85  0.1uF  C-EUC0402  [C0402]
C90  10uF  C-EUC0805  [C0805]
IC4  74AHC1G126DCK  [SC70-5]
IC9  74AHC1G126DCK  [SC70-5]
IC14  74AHC1G126DCK  [SC70-5]
IC19  TMC2100-LA  [QFN36-PAD]
J503  22-05-7048-04  [7395-04]
R31  2.2R  R-EU_R0402  [R0402]
R32  10K  R-EU_R0402  [R0402]
R33  10K  R-EU_R0402  [R0402]
R34  4.7K  R-EU_R0402  [R0402]
R50  0.1R  R-EU_R0805  [R0805]
R51  0.1R  R-EU_R0805  [R0805]
U7  SN74AHC595PW  [SOP65P640X120-16N]

### Nets
+3V3: C23.1 C31.1 C44.1 IC4.5(VCC) IC9.5(VCC) IC14.5(VCC) IC19.8(VCC_IO) R34.2 U7.10(~SRCLR) U7.16(VCC) ; also sheet 1,2,3,4,6
DIR_Y: IC19.7(REFR_DIR) ; also sheet 1
EN_XYZ: IC4.2(I) ; also sheet 2,4
ENABLE_Y: IC4.4(O) IC19.22(DRV_ENN_CFG6)
FAULT_Y: IC19.20(SWN_DIAG0) R34.1 ; also sheet 1
GND: C23.2 C31.2 C40.2 C41.1 C42.2 C43.2 C44.2 C67.1 C75.2 C80.- C85.2 C90.2 IC4.3(GND) IC9.3(GND) IC14.3(GND) IC19.1(CLK) IC19.10(SPI_MODE) IC19.11(GND) IC19.12(GND) IC19.24(GNDA) IC19.35(GND) IC19.36(TST_MODE) IC19.TP(GND) R50.1 R51.1 U7.8(GND) U7.13(~OE) ; also sheet 1,2,3,4,6
IREF_Y_RAW: R33.2 ; also sheet 1
IREF_Z9: C43.1 R32.2 R33.1
N$72: C39.2 IC19.27(CPO)
N$74: IC19.14(BRB) R51.2
N$75: IC19.33(BRA) R50.2
N$76: C42.1 IC19.23(AIN_IREF) R32.1
N$79: C39.1 IC19.28(CPI)
N$80: IC14.4(O) IC19.3(SCK_CFG2)
N$81: IC19.15(OB2) J503.4
N$82: IC19.34(OA1) J503.2
N$83: C41.2 IC19.25(5VOUT) R31.1
N$84: C66.1 IC19.29(VCP)
N$85: IC9.4(O) IC19.4(SDI_NAI_CFG1)
N$86: IC19.5(SDO_NAO_CFG0) U7.3(QD)
N$87: IC19.18(ENCB_DCEN_CFG4) U7.2(QC)
N$89: IC19.19(ENCA_DCIN_CFG5) U7.1(QB)
N$90: IC9.1(OE) U7.7(QH)
N$91: IC9.2(I) U7.6(QG)
N$92: IC14.2(I) U7.4(QE)
N$93: IC14.1(OE) U7.5(QF)
N$94: C40.1 IC19.26(VCC) R31.2
N$95: IC19.32(OA2) J503.1
N$98: IC19.13(OB1) J503.3
SER_2: U7.14(SER) ; also sheet 4
SER_3: U7.9(QH_2) ; also sheet 2
SERVO_0_EN: U7.15(QA) ; also sheet 1
SPI1_CS1: U7.12(RCLK) ; also sheet 1,2,3,4,6
SPI1_SCLK: U7.11(SRCLK) ; also sheet 1,2,3,4,6
STEP_Y: IC19.6(REFL_STEP) ; also sheet 1
TRISTATE_STEPPERS: IC4.1(OE) ; also sheet 2,3,4,6
VDD_IN: C66.2 C67.2 C75.1 C80.+ C85.1 C90.1 IC19.16(VS) IC19.30(VSA) IC19.31(VS) ; also sheet 1,2,3,4,6
Unconnected: IC19.2(CSN_CFG3) IC19.9(SD_MODE) IC19.17(ENCN_DCO) IC19.21(SWP_DIAG1)

## Sheet 6 of 6
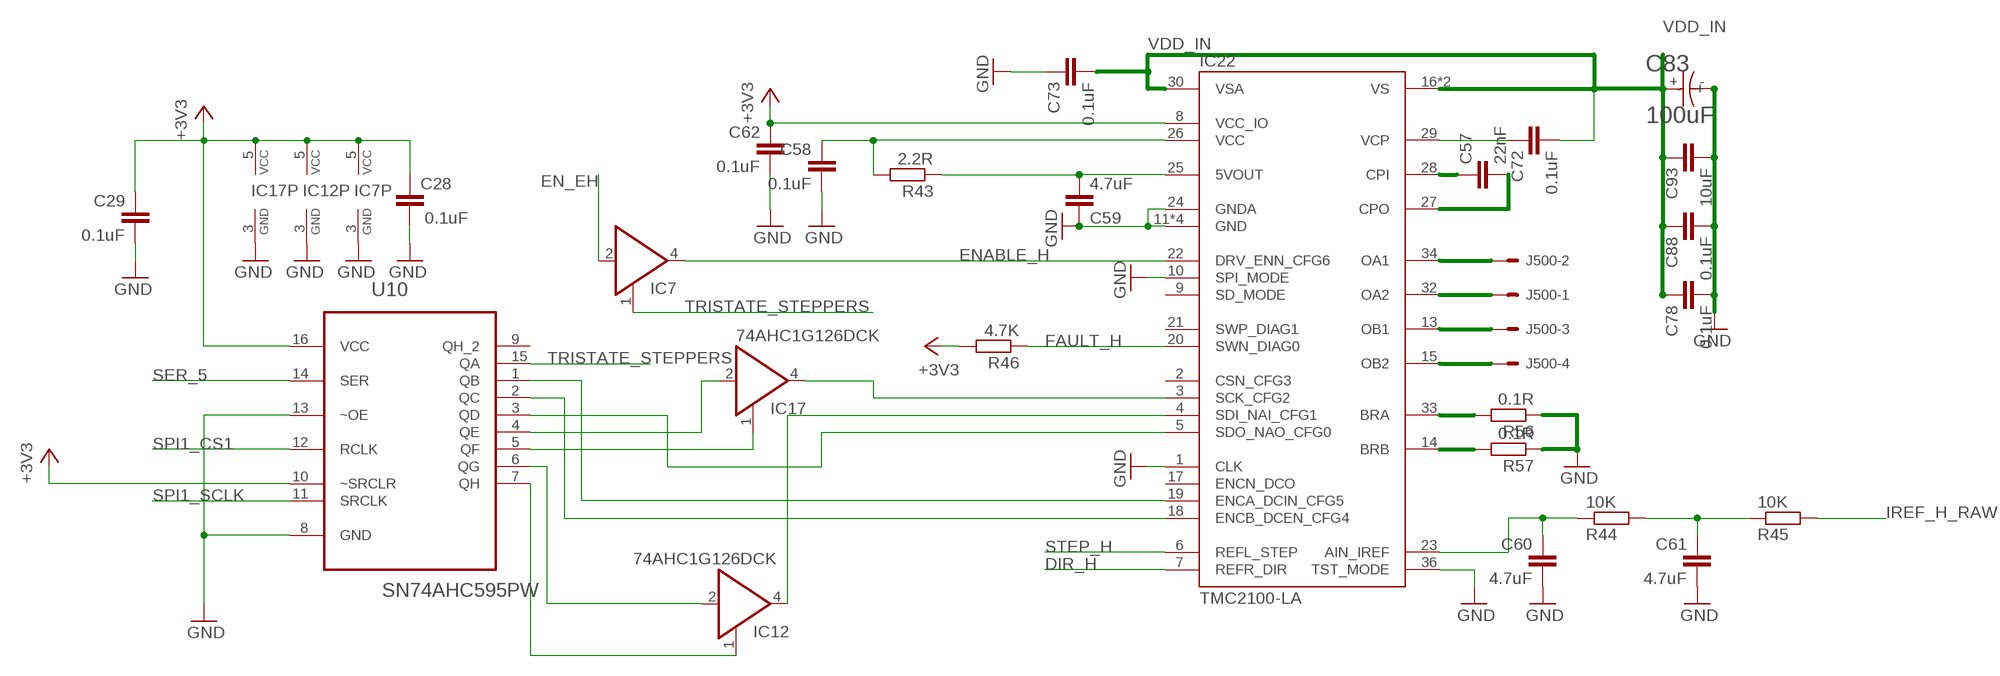
[diagram p6: schematic, sheet 6]

### Parts
C28  0.1uF  C-EUC0402  [C0402]
C29  0.1uF  C-EUC0402  [C0402]
C57  22nF  C-EUC0402  [C0402]
C58  0.1uF  C-EUC0402  [C0402]
C59  4.7uF  C-EUC0402  [C0402]
C60  4.7uF  C-EUC0402  [C0402]
C61  4.7uF  C-EUC0402  [C0402]
C62  0.1uF  C-EUC0402  [C0402]
C72  0.1uF  C-EUC0402  [C0402]
C73  0.1uF  C-EUC0402  [C0402]
C78  0.1uF  C-EUC0402  [C0402]
C83  100uF  C  [RHS1V10MCN1GS]
C88  0.1uF  C-EUC0402  [C0402]
C93  10uF  C-EUC0805  [C0805]
IC7  74AHC1G126DCK  [SC70-5]
IC12  74AHC1G126DCK  [SC70-5]
IC17  74AHC1G126DCK  [SC70-5]
IC22  TMC2100-LA  [QFN36-PAD]
J500  22-05-7048-04  [7395-04]
R43  2.2R  R-EU_R0402  [R0402]
R44  10K  R-EU_R0402  [R0402]
R45  10K  R-EU_R0402  [R0402]
R46  4.7K  R-EU_R0402  [R0402]
R56  0.1R  R-EU_R0805  [R0805]
R57  0.1R  R-EU_R0805  [R0805]
U10  SN74AHC595PW  [SOP65P640X120-16N]

### Nets
+3V3: C28.1 C29.1 C62.1 IC7.5(VCC) IC12.5(VCC) IC17.5(VCC) IC22.8(VCC_IO) R46.2 U10.10(~SRCLR) U10.16(VCC) ; also sheet 1,2,3,4,5
DIR_H: IC22.7(REFR_DIR) ; also sheet 1
EN_EH: IC7.2(I) ; also sheet 3
ENABLE_H: IC7.4(O) IC22.22(DRV_ENN_CFG6)
FAULT_H: IC22.20(SWN_DIAG0) R46.1 ; also sheet 1
GND: C28.2 C29.2 C58.2 C59.1 C60.2 C61.2 C62.2 C73.1 C78.2 C83.- C88.2 C93.2 IC7.3(GND) IC12.3(GND) IC17.3(GND) IC22.1(CLK) IC22.10(SPI_MODE) IC22.11(GND) IC22.12(GND) IC22.24(GNDA) IC22.35(GND) IC22.36(TST_MODE) IC22.TP(GND) R56.1 R57.1 U10.8(GND) U10.13(~OE) ; also sheet 1,2,3,4,5
IREF_H_RAW: R45.2 ; also sheet 1
IREF_Z10: C61.1 R44.2 R45.1
N$99: C57.2 IC22.27(CPO)
N$100: IC22.14(BRB) R57.2
N$101: IC22.33(BRA) R56.2
N$102: C60.1 IC22.23(AIN_IREF) R44.1
N$103: C57.1 IC22.28(CPI)
N$104: IC17.4(O) IC22.3(SCK_CFG2)
N$105: IC22.15(OB2) J500.4
N$106: IC22.34(OA1) J500.2
N$107: C59.2 IC22.25(5VOUT) R43.1
N$108: C72.1 IC22.29(VCP)
N$109: IC12.4(O) IC22.4(SDI_NAI_CFG1)
N$110: IC22.5(SDO_NAO_CFG0) U10.3(QD)
N$111: IC22.18(ENCB_DCEN_CFG4) U10.2(QC)
N$113: IC22.19(ENCA_DCIN_CFG5) U10.1(QB)
N$119: IC12.1(OE) U10.7(QH)
N$167: IC12.2(I) U10.6(QG)
N$168: IC17.2(I) U10.4(QE)
N$180: IC17.1(OE) U10.5(QF)
N$181: C58.1 IC22.26(VCC) R43.2
N$224: IC22.32(OA2) J500.1
N$225: IC22.13(OB1) J500.3
SER_5: U10.14(SER) ; also sheet 3
SPI1_CS1: U10.12(RCLK) ; also sheet 1,2,3,4,5
SPI1_SCLK: U10.11(SRCLK) ; also sheet 1,2,3,4,5
STEP_H: IC22.6(REFL_STEP) ; also sheet 1
TRISTATE_STEPPERS: IC7.1(OE) U10.15(QA) ; also sheet 2,3,4,5
VDD_IN: C72.2 C73.2 C78.1 C83.+ C88.1 C93.1 IC22.16(VS) IC22.30(VSA) IC22.31(VS) ; also sheet 1,2,3,4,5
Unconnected: IC22.2(CSN_CFG3) IC22.9(SD_MODE) IC22.17(ENCN_DCO) IC22.21(SWP_DIAG1) U10.9(QH_2)

## Library data of the parts
3.3V 5V 12..24V 12V = testpad:TP: Test pad
C1 C2 C9-C11 C13 = rcl:C-EU: CAPACITOR, European symbol; MPN: CL31B106KAHNNNE
C3 C32 C63 = rcl:C-EU: CAPACITOR, European symbol; MPN: CL05B472KA5NNNC
C4-C6 C35-C37 C41-C43 C47-C49 C53-C55 C59-C61 = rcl:C-EU: CAPACITOR, European symbol; MPN: GRM155R60J475ME47D
C7 C8 C12 C18 C19 C22-C31 C34 C38 C40 C44 C46 C50 C52 C56 C58 C62 C64-C78 C84-C88 = rcl:C-EU: CAPACITOR, European symbol; MPN: CL10B104KB8NNND
C14 C17 = rcl:C-EU: CAPACITOR, European symbol; MPN: C1005X7R1H102K050BA
C15 C16 C20 C21 = rcl:C-EU: CAPACITOR, European symbol; MPN: CL05B103KB5NNNC
C33 C39 C45 C51 C57 = rcl:C-EU: CAPACITOR, European symbol; MPN: C1005X7R1E223K050BB
C79-C83 = Panasonic-EEEFK_EEEFP:C; MPN: RHS1V101MCN1GS
C89-C93 = rcl:C-EU: CAPACITOR, European symbol; MPN: C2012X5R1V106M085AC
D1-D6 = diode:MBRA340T3: Surface Mount Schottky Power Rectifier Source: http://www.onsemi.com/pub_link/Collateral/MBRA340T3-D.PDF; MPN: MBRA340T3G
F1 = fuse:FUSE: Fuse; MPN: 0891020.NXS
FH1 FH2 = Replicape_Rev_B0:FUSE-HOLDER; MPN: 3557
IC1-IC17 = 74xx-little-de:74*1G126: Single Bus Buffer Gate With 3-State Outputs; MPN: M74VHC1GT126DF1G
IC18-IC22 = we-chip:TMC2100: Trinamic TMC2100 Stepper Motor Driver (5V...46V, 1.2A, peak 1.7A, 256 microsteps); MPN: TMC2100-LA-T
J500-J504 X10 = con-molex:22-?-04: CONNECTOR wire to board 2.54 mm (.1 inch) pitch header; MPN: 640455-4; OC_FARNELL: unknown; OC_NEWARK: unknown
JP1 JP2 = SparkFun:FIDUCIAL: Fiducial Alignment Points Various fiducial points for machine vision alignment.
L1 L2 = SparkFun:RT8040T330; MPN: NR8040T330M
LED1-LED7 = led:LED: LED OSRAM: - CHIPLED LG R971, LG N971, LY N971, LG Q971, LY Q971, LO R971, LY R971 LH N974, LH R974 LS Q976, LO Q976, LY Q976 LO Q996 - Hyper CHIPLED LW Q18S LB Q993, LB Q99A, LB R99A - SideLED LS A670, LO A670, LY A670, LG A670, LP A670 LB A673, LV A673, LT A673, LW A673 LH A674 LY A675 LS A676, LA A676, LO A676, LY A676, LW A676 LS A679, LY A679, LG A679 - Hyper Micro SIDELED® LS Y876, LA Y876, LO Y876, LY Y876 LT Y87S - SmartLED LW L88C, LW L88S LB L89C, LB L89S, LG L890 LS L89K, LO L89K, LY L89K LS L896, LA L896, LO L896, LY L896 - TOPLED LS T670, LO T670, LY T670, LG T670, LP T670 LSG T670, LSP T670, LSY T670, LOP T670, LYG T670 LG T671, LOG T671, LSG T671 LB T673, LV T673, LT T673, LW T673 LH T674 LS T676, LA T676, LO T676, LY T676, LB T676, LH T676, LSB T676, LW T676 LB T67C, LV T67C, LT T67C, LS T67K, LO T67K, LY T67K, LW E67C LS E67B, LA E67B, LO E67B, LY E67B, LB E67C, LV E67C, LT E67C LW T67C LS T679, LY T679, LG T679 LS T770, LO T770, LY T770, LG T770, LP T770 LB T773, LV T773, LT T773, LW T773 LH T774 LS E675, LA E675, LY E675, LS T675 LS T776, LA T776, LO T776, LY T776, LB T776 LHGB T686 LT T68C, LB T68C - Hyper Mini TOPLED® LB M676 - Mini TOPLED Santana® LG M470 LS M47K, LO M47K, LY M47K Source: http://www.osram.convergy.de LUXEON: - LUMILED® LXK2-PW12-R00, LXK2-PW12-S00, LXK2-PW14-U00, LXK2-PW14-V00 LXK2-PM12-R00, LXK2-PM12-S00, LXK2-PM14-U00 LXK2-PE12-Q00, LXK2-PE12-R00, LXK2-PE12-S00, LXK2-PE14-T00, LXK2-PE14-U00 LXK2-PB12-K00, LXK2-PB12-L00, LXK2-PB12-M00, LXK2-PB14-N00, LXK2-PB14-P00, LXK2-PB14-Q00 LXK2-PR12-L00, LXK2-PR12-M00, LXK2-PR14-Q00, LXK2-PR14-R00 LXK2-PD12-Q00, LXK2-PD12-R00, LXK2-PD12-S00 LXK2-PH12-R00, LXK2-PH12-S00 LXK2-PL12-P00, LXK2-PL12-Q00, LXK2-PL12-R00 Source: www.luxeon.com KINGBRIGHT: KA-3528ASYC Source: www.kingbright.com; MPN: Q65110A7211
LOGO1 = ohw-logo:OSHW_LOGO_FILL
P1 P2 = con-headers-jp:F-2X23-; MPN: SSHQ-123-D-08-F-LF
Q1-Q3 = transistor-power:AON6758; MPN: SIRA34DP-T1-GE3
Q4 Q5 = semicon-smd-ipc:NPN-TRANSISTOR_: NPN TRANSISTOR; MPN: AO7400
R1-R8 R15 R21 R22 R24-R26 R30 R34 R38 R42 R46 R47 R58-R64 = rcl:R-EU_: RESISTOR, European symbol; MPN: RC0402JR-074K7L
R9 R12 R13 = rcl:R-EU_: RESISTOR, European symbol; MPN: RC0402FR-074K7L
R10 R11 R14 R16 R18 R28 R29 R32 R33 R36 R37 R40 R41 R44 R45 = rcl:R-EU_: RESISTOR, European symbol; MPN: RC0402FR-0710KL
R17 = rcl:R-EU_: RESISTOR, European symbol; MPN: RC1005F4422CS
R19 = rcl:R-EU_: RESISTOR, European symbol; MPN: RMCF0402FT120K
R20 R23 = rcl:R-EU_: RESISTOR, European symbol; MPN: RC1005J393CS
R27 R31 R35 R39 R43 = rcl:R-EU_: RESISTOR, European symbol; MPN: RC1005J2R2CS
R48-R57 = rcl:R-EU_: RESISTOR, European symbol; MPN: RL1220S-R10-F
SV1 = con-lstb:MA03-1: PIN HEADER; OC_FARNELL: unknown; OC_NEWARK: unknown
U1 = custom:PCA9685PW: 16-channel, 12-bit PWM Fm+ I2C-bus LED controller; MPN: PCA9685PW,112; OC_FARNELL: 1854074; OC_NEWARK: 19T6398; PACKAGE: TSSOP-28; SUPPLIER: NXP
U2 = custom:CAT24C256; MPN: CAT24C256WI-GT3
U3 = TI-CD4050BD:CD4050BD: CMOS Hex Buffer/Converters; MPN: CD4050BDR; OC_FARNELL: 1740857; OC_NEWARK: 50R5062; PACKAGE: 16-SOIC; SUPPLIER: Texas Instruments
U4 U5 = SparkFun:RT8268; MPN: RT8268GFP
U6-U10 = sn74hc595:SN74AHC595PW: 8 bit shift registers with 3-state output registers; MPN: MC74HC595ADTR2G; OC_FARNELL: 1741463; OC_NEWARK: 50R5930; PACKAGE: TSSOP-16; SUPPLIER: Texas Instruments
U$1 = Replicape_B3:CC-BY-SA
X1 X5-X9 = con-molex:22-?-03: CONNECTOR wire to board 2.54 mm (.1 inch) pitch header; MPN: 640455-3; OC_FARNELL: unknown; OC_NEWARK: unknown
X2-X4 X15 X16 = con-molex:22-?-02: CONNECTOR wire to board 2.54 mm (.1 inch) pitch header; MPN: 640455-2; OC_FARNELL: 9731601; OC_NEWARK: unknown
X11 X13 = con-phoenix-508:MSTBA2: PHOENIX; MF: FARNELL; MPN: 39532-1002; OC_FARNELL: 3705171; OC_NEWARK: 71C4161
X12 X14 = con-phoenix-508:MSTBA4: PHOENIX; MF: FARNELL; MPN: 39532-1004; OC_FARNELL: 3705195; OC_NEWARK: 71C4163
XC1 XC3 = con-phoenix-508:MSTBV2-CONNECTOR; MPN: 39530-0002
XC2 XC4 = con-phoenix-508:MSTBA4-CONNECTOR; MPN: 39530-0004

## Net classes
1 power: width 1.27 mm